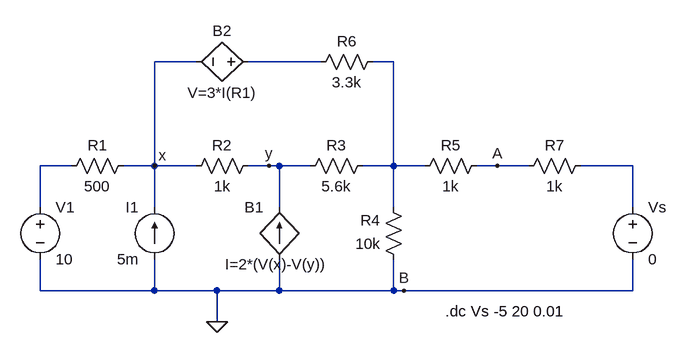
[diagram p0: schematic Circuit 4.asc]
Circuit 4.asc, the LTspice schematic file:
Version 4
SHEET 1 984 680
WIRE 256 -80 192 -80
WIRE 448 -80 336 -80
WIRE 560 -80 528 -80
WIRE 64 80 16 80
WIRE 192 80 192 -80
WIRE 192 80 144 80
WIRE 256 80 192 80
WIRE 368 80 336 80
WIRE 384 80 368 80
WIRE 432 80 384 80
WIRE 560 80 560 -80
WIRE 560 80 512 80
WIRE 608 80 560 80
WIRE 720 80 688 80
WIRE 768 80 720 80
WIRE 928 80 848 80
WIRE 16 144 16 80
WIRE 192 144 192 80
WIRE 384 144 384 80
WIRE 560 144 560 80
WIRE 928 144 928 80
WIRE 16 272 16 224
WIRE 192 272 192 224
WIRE 192 272 16 272
WIRE 288 272 192 272
WIRE 384 272 384 224
WIRE 384 272 288 272
WIRE 560 272 560 224
WIRE 560 272 384 272
WIRE 576 272 560 272
WIRE 928 272 928 224
WIRE 928 272 576 272
WIRE 288 320 288 272
FLAG 288 320 0
FLAG 192 80 x
FLAG 368 80 y
FLAG 576 272 B
FLAG 720 80 A
SYMBOL voltage 16 128 R0
SYMATTR InstName V1
SYMATTR Value 10
SYMBOL current 192 224 R180
WINDOW 0 24 80 Left 2
WINDOW 3 24 0 Left 2
SYMATTR InstName I1
SYMATTR Value 5m
SYMBOL res 160 64 R90
WINDOW 0 0 56 VBottom 2
WINDOW 3 32 56 VTop 2
SYMATTR InstName R1
SYMATTR Value 500
SYMBOL res 240 96 R270
WINDOW 0 32 56 VTop 2
WINDOW 3 0 56 VBottom 2
SYMATTR InstName R2
SYMATTR Value 1k
SYMBOL res 528 64 R90
WINDOW 0 0 56 VBottom 2
WINDOW 3 32 56 VTop 2
SYMATTR InstName R3
SYMATTR Value 5.6k
SYMBOL res 592 96 R270
WINDOW 0 32 56 VTop 2
WINDOW 3 0 56 VBottom 2
SYMATTR InstName R5
SYMATTR Value 1k
SYMBOL res 576 240 R180
WINDOW 0 36 76 Left 2
WINDOW 3 36 40 Left 2
SYMATTR InstName R4
SYMATTR Value 10k
SYMBOL res 432 -64 R270
WINDOW 0 32 56 VTop 2
WINDOW 3 0 56 VBottom 2
SYMATTR InstName R6
SYMATTR Value 3.3k
SYMBOL bv 352 -80 R90
WINDOW 0 -32 56 VBottom 2
WINDOW 3 32 56 VTop 2
SYMATTR InstName B2
SYMATTR Value V=3*I(R1)
SYMBOL bi 384 224 R180
WINDOW 0 24 80 Left 2
WINDOW 3 -73 -7 Left 2
SYMATTR InstName B1
SYMATTR Value I=2*(V(x)-V(y))
SYMBOL res 864 64 R90
WINDOW 0 0 56 VBottom 2
WINDOW 3 32 56 VTop 2
SYMATTR InstName R7
SYMATTR Value 1k
SYMBOL voltage 928 128 R0
SYMATTR InstName Vs
SYMATTR Value 0
TEXT 640 304 Left 2 !.dc Vs -5 20 0.01

The netlist it stands for:
* Circuit 4.asc
V1 N003 0 10
I1 0 x 5m
R1 x N003 500
R2 x y 1k
R3 N002 y 5.6k
R5 N002 A 1k
R4 0 N002 10k
R6 N001 N002 3.3k
B2 N001 x V=3*I(R1)
B1 0 y I=2*(V(x)-V(y))
R7 N004 A 1k
Vs N004 0 0
.dc Vs -5 20 0.01
.backanno
.end

* Results of the author's LTspice run, read from the files saved beside the schematic
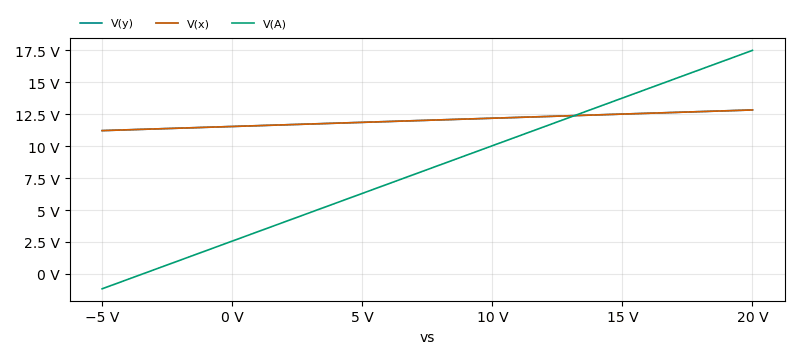
[diagram p1: DC transfer characteristic of Circuit 4.asc, plotted from the saved traces]
* DC transfer characteristic, 1 run:
*   V(y): 11.21 V at vs=-5 V, 12.82 V at vs=20 V, min 11.21 V, max 12.82 V
*   V(x): 11.21 V at vs=-5 V, 12.82 V at vs=20 V, min 11.21 V, max 12.82 V
*   V(A): -1.16 V at vs=-5 V, 17.48 V at vs=20 V, min -1.16 V, max 17.48 V